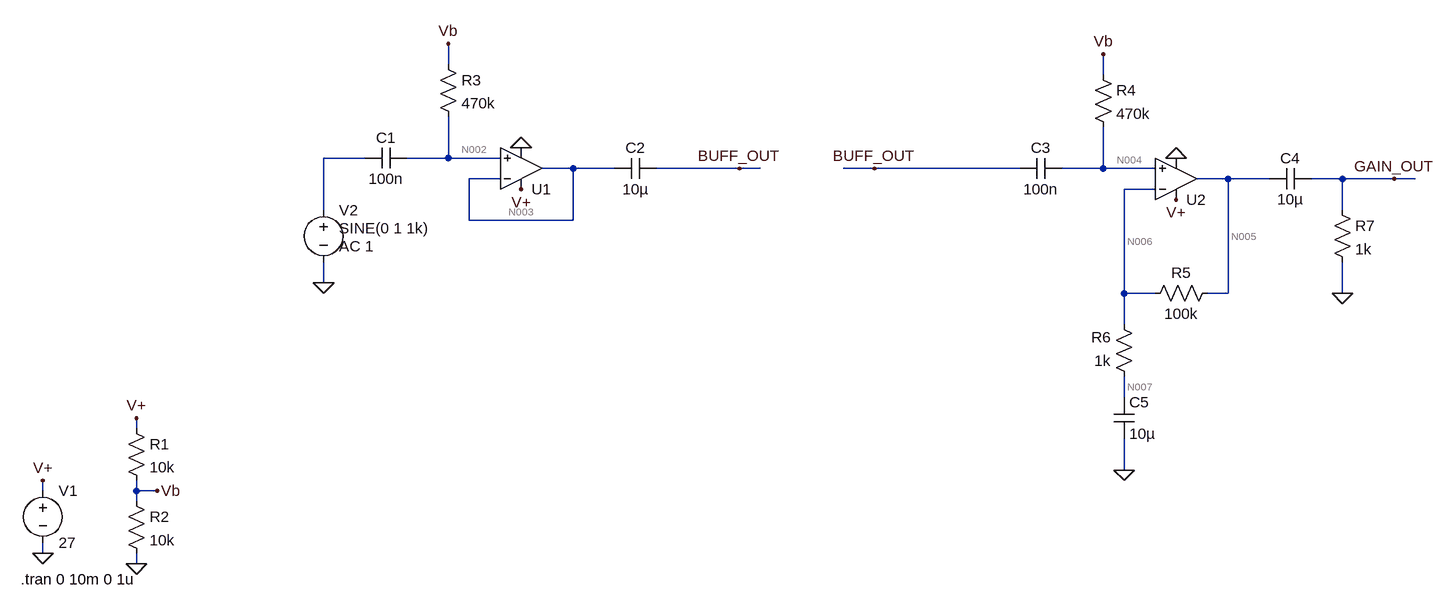
[diagram p0: schematic Liquid_Boost.asc]
Liquid_Boost.asc, the LTspice schematic file:
Version 4
SHEET 1 2192 680
WIRE 656 -528 656 -560
WIRE 1664 -512 1664 -544
WIRE 528 -384 464 -384
WIRE 656 -384 656 -448
WIRE 656 -384 592 -384
WIRE 736 -384 656 -384
WIRE 848 -368 800 -368
WIRE 912 -368 848 -368
WIRE 1104 -368 976 -368
WIRE 1136 -368 1104 -368
WIRE 1312 -368 1264 -368
WIRE 1536 -368 1312 -368
WIRE 1664 -368 1664 -432
WIRE 1664 -368 1600 -368
WIRE 1744 -368 1664 -368
WIRE 736 -352 688 -352
WIRE 1856 -352 1808 -352
WIRE 1920 -352 1856 -352
WIRE 2032 -352 1984 -352
WIRE 2112 -352 2032 -352
WIRE 2144 -352 2112 -352
WIRE 1744 -336 1696 -336
WIRE 464 -304 464 -384
WIRE 2032 -304 2032 -352
WIRE 688 -288 688 -352
WIRE 848 -288 848 -368
WIRE 848 -288 688 -288
WIRE 464 -192 464 -224
WIRE 1696 -176 1696 -336
WIRE 1744 -176 1696 -176
WIRE 1856 -176 1856 -352
WIRE 1856 -176 1824 -176
WIRE 2032 -176 2032 -224
WIRE 1696 -128 1696 -176
WIRE 1696 -16 1696 -48
WIRE 176 32 176 16
WIRE 1696 96 1696 48
WIRE 32 128 32 112
WIRE 176 128 176 112
WIRE 208 128 176 128
WIRE 176 144 176 128
WIRE 32 224 32 208
WIRE 176 240 176 224
FLAG 32 224 0
FLAG 32 112 V+
FLAG 176 240 0
FLAG 176 16 V+
FLAG 208 128 Vb
FLAG 464 -192 0
FLAG 656 -560 Vb
FLAG 768 -336 V+
FLAG 768 -400 0
FLAG 1104 -368 BUFF_OUT
FLAG 1664 -544 Vb
FLAG 1776 -320 V+
FLAG 1776 -384 0
FLAG 1312 -368 BUFF_OUT
FLAG 2112 -352 GAIN_OUT
FLAG 1696 96 0
FLAG 2032 -176 0
SYMBOL voltage 32 112 R0
WINDOW 123 0 0 Left 0
WINDOW 39 0 0 Left 0
SYMATTR InstName V1
SYMATTR Value 27
SYMBOL res 160 16 R0
SYMATTR InstName R1
SYMATTR Value 10k
SYMBOL res 160 128 R0
SYMATTR InstName R2
SYMATTR Value 10k
SYMBOL voltage 464 -320 R0
WINDOW 3 24 44 Left 2
WINDOW 123 24 72 Left 2
WINDOW 39 0 0 Left 0
SYMATTR InstName V2
SYMATTR Value SINE(0 1 1k)
SYMATTR Value2 AC 1
SYMBOL cap 592 -400 R90
WINDOW 0 0 32 VBottom 2
WINDOW 3 32 32 VTop 2
SYMATTR InstName C1
SYMATTR Value 100n
SYMBOL res 640 -544 R0
SYMATTR InstName R3
SYMATTR Value 470k
SYMBOL cap 976 -384 R90
WINDOW 0 0 32 VBottom 2
WINDOW 3 32 32 VTop 2
SYMATTR InstName C2
SYMATTR Value 10µ
SYMBOL OpAmps\\UniversalOpamp2 768 -368 M180
SYMATTR InstName U1
SYMBOL cap 1600 -384 R90
WINDOW 0 0 32 VBottom 2
WINDOW 3 32 32 VTop 2
SYMATTR InstName C3
SYMATTR Value 100n
SYMBOL res 1648 -528 R0
SYMATTR InstName R4
SYMATTR Value 470k
SYMBOL cap 1984 -368 R90
WINDOW 0 0 32 VBottom 2
WINDOW 3 32 32 VTop 2
SYMATTR InstName C4
SYMATTR Value 10µ
SYMBOL OpAmps\\UniversalOpamp2 1776 -352 M180
SYMATTR InstName U2
SYMBOL res 1840 -192 R90
WINDOW 0 0 56 VBottom 2
WINDOW 3 32 56 VTop 2
SYMATTR InstName R5
SYMATTR Value 100k
SYMBOL res 1712 -32 R180
WINDOW 0 36 76 Left 2
WINDOW 3 36 40 Left 2
SYMATTR InstName R6
SYMATTR Value 1k
SYMBOL cap 1680 -16 R0
SYMATTR InstName C5
SYMATTR Value 10µ
SYMBOL res 2016 -320 R0
SYMATTR InstName R7
SYMATTR Value 1k
TEXT -2 264 Left 2 !.tran 0 10m 0 1u

The netlist it stands for:
* Liquid_Boost.asc
V1 V+ 0 27
R1 V+ Vb 10k
R2 Vb 0 10k
V2 N001 0 SINE(0 1 1k) AC 1
C1 N002 N001 100n
R3 Vb N002 470k
C2 BUFF_OUT N003 10µ
XU1 N002 N003 V+ 0 N003 level.2 Avol=1Meg GBW=10Meg Slew=10Meg ilimit=25m rail=0 Vos=0 phimargin=45 en=0 enk=0 in=0 ink=0 Rin=500Meg  ; pins IN+ IN- V+ V- OUT
C3 N004 BUFF_OUT 100n
R4 Vb N004 470k
C4 GAIN_OUT N005 10µ
XU2 N004 N006 V+ 0 N005 level.2 Avol=1Meg GBW=10Meg Slew=10Meg ilimit=25m rail=0 Vos=0 phimargin=45 en=0 enk=0 in=0 ink=0 Rin=500Meg  ; pins IN+ IN- V+ V- OUT
R5 N005 N006 100k
R6 N007 N006 1k
C5 N007 0 10µ
R7 GAIN_OUT 0 1k
.tran 0 10m 0 1u
.lib UniversalOpamps2.sub
.backanno
.end

* Results of the author's LTspice run, read from the files saved beside the schematic
* Operating Point, zero values left out:
*   V(v+) = 27 V
*   V(vb) = 13.5 V
*   V(n002) = 13.5 V
*   V(buff_out) = 136.3 µV
*   V(n003) = 13.5 V
*   V(n004) = 13.5 V
*   V(n005) = 13.5 V
*   V(n006) = 13.5 V
*   V(n007) = 13.5 V
*   I(R2) = 1.35 mA
*   I(R1) = 1.35 mA
*   I(V1) = -4.048 mA
*   Ix(u1:3) = 1.349 mA
*   Ix(u1:4) = -1.349 mA
*   Ix(u2:3) = 1.349 mA
*   Ix(u2:4) = -1.349 mA
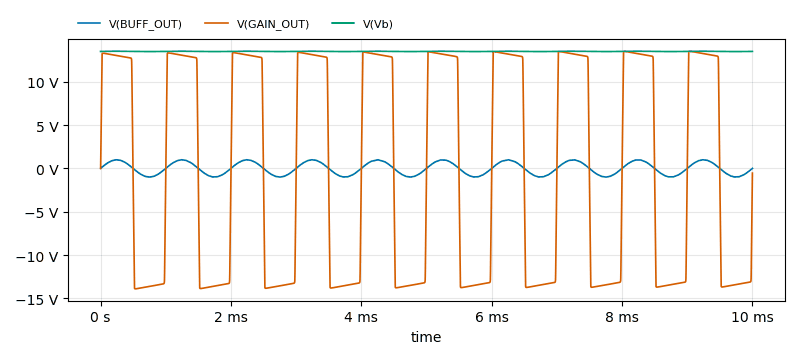
[diagram p1: Transient Analysis of Liquid_Boost.asc, plotted from the saved traces]
* Transient Analysis, 1 run:
*   V(BUFF_OUT): min -1.002 V, max 996.1 mV, average -3.73 mV, rms 699.7 mV, last 667.5 µV
*   V(GAIN_OUT): min -13.9 V, max 13.52 V, average -244.8 mV, rms 12.95 V, last -540.3 mV
*   V(Vb): min 13.48 V, max 13.52 V, average 13.5 V, rms 13.5 V, last 13.5 V